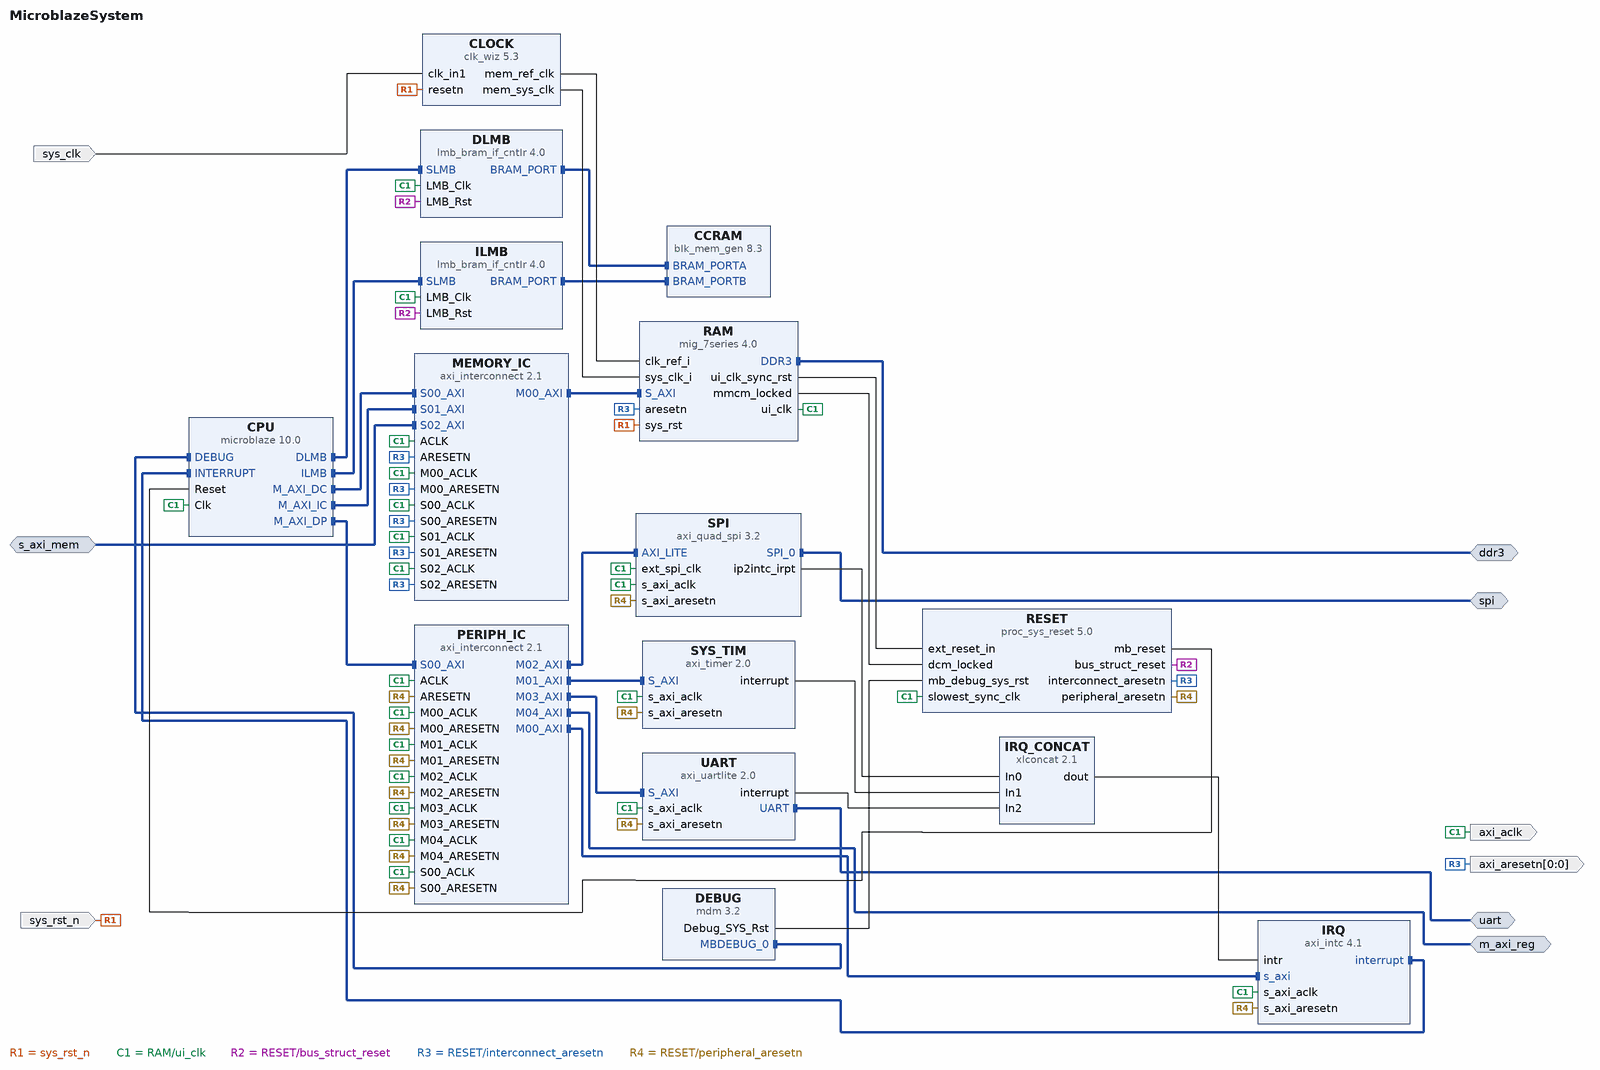
[diagram p0: block diagram of the top level]
# Vivado block design MicroblazeSystem, xc7a35ticsg324-1L, Vivado 2016.4
create_bd_design MicroblazeSystem

create_bd_intf_port -mode Master -vlnv xilinx.com:interface:ddrx_rtl:1.0 ddr3
create_bd_intf_port -mode Slave -vlnv xilinx.com:interface:aximm_rtl:1.0 s_axi_mem
set_property -dict [list \
  CONFIG.DATA_WIDTH 32 \
  CONFIG.PROTOCOL AXI4 \
  CONFIG.ID_WIDTH 2 \
  CONFIG.ADDR_WIDTH 32 \
  CONFIG.AWUSER_WIDTH 0 \
  CONFIG.ARUSER_WIDTH 0 \
  CONFIG.WUSER_WIDTH 0 \
  CONFIG.RUSER_WIDTH 0 \
  CONFIG.BUSER_WIDTH 0 \
  CONFIG.READ_WRITE_MODE READ_WRITE \
  CONFIG.HAS_BURST 1 \
  CONFIG.HAS_LOCK 1 \
  CONFIG.HAS_PROT 1 \
  CONFIG.HAS_CACHE 1 \
  CONFIG.HAS_QOS 1 \
  CONFIG.HAS_REGION 0 \
  CONFIG.HAS_WSTRB 1 \
  CONFIG.HAS_BRESP 1 \
  CONFIG.HAS_RRESP 1 \
  CONFIG.SUPPORTS_NARROW_BURST 1 \
  CONFIG.NUM_READ_OUTSTANDING 2 \
  CONFIG.NUM_WRITE_OUTSTANDING 2 \
  CONFIG.MAX_BURST_LENGTH 256 \
  CONFIG.NUM_READ_THREADS 1 \
  CONFIG.NUM_WRITE_THREADS 1 \
  CONFIG.RUSER_BITS_PER_BYTE 0 \
  CONFIG.WUSER_BITS_PER_BYTE 0 \
] [get_bd_intf_ports s_axi_mem]
create_bd_intf_port -mode Master -vlnv xilinx.com:interface:aximm_rtl:1.0 m_axi_reg
set_property -dict [list \
  CONFIG.DATA_WIDTH 32 \
  CONFIG.PROTOCOL AXI4LITE \
  CONFIG.ADDR_WIDTH 32 \
  CONFIG.NUM_READ_OUTSTANDING 2 \
  CONFIG.NUM_WRITE_OUTSTANDING 2 \
] [get_bd_intf_ports m_axi_reg]
create_bd_intf_port -mode Master -vlnv xilinx.com:interface:uart_rtl:1.0 uart
create_bd_intf_port -mode Master -vlnv xilinx.com:interface:spi_rtl:1.0 spi
create_bd_port -dir I -type rst sys_rst_n
create_bd_port -dir I -type clk sys_clk
set_property -dict {CONFIG.FREQ_HZ 100000000} [get_bd_ports sys_clk]
create_bd_port -dir O -type clk axi_aclk
set_property -dict {CONFIG.ASSOCIATED_BUSIF m_axi_reg:s_axi_mem CONFIG.ASSOCIATED_RESET axi_aresetn} [get_bd_ports axi_aclk]
create_bd_port -dir O -from 0 -to 0 -type rst axi_aresetn

create_bd_cell -type ip -vlnv xilinx.com:ip:mig_7series:4.0 RAM
set_property -dict [list \
  CONFIG.XML_INPUT_FILE mig_a.prj \
  CONFIG.RESET_BOARD_INTERFACE Custom \
  CONFIG.BOARD_MIG_PARAM Custom \
] [get_bd_cells RAM]
create_bd_cell -type ip -vlnv xilinx.com:ip:clk_wiz:5.3 CLOCK
set_property -dict [list \
  CONFIG.CLKOUT2_USED true \
  CONFIG.NUM_OUT_CLKS 2 \
  CONFIG.CLK_OUT1_PORT mem_sys_clk \
  CONFIG.CLK_OUT2_PORT mem_ref_clk \
  CONFIG.CLKOUT1_REQUESTED_OUT_FREQ 333.333 \
  CONFIG.CLKOUT2_REQUESTED_OUT_FREQ 200.000 \
  CONFIG.USE_LOCKED false \
  CONFIG.RESET_PORT resetn \
  CONFIG.MMCM_DIVCLK_DIVIDE 1 \
  CONFIG.MMCM_CLKFBOUT_MULT_F 10.000 \
  CONFIG.MMCM_CLKOUT0_DIVIDE_F 3.000 \
  CONFIG.MMCM_CLKOUT1_DIVIDE 5 \
  CONFIG.RESET_TYPE ACTIVE_LOW \
  CONFIG.CLKOUT1_JITTER 104.542 \
  CONFIG.CLKOUT1_PHASE_ERROR 98.575 \
  CONFIG.CLKOUT2_JITTER 114.829 \
  CONFIG.CLKOUT2_PHASE_ERROR 98.575 \
] [get_bd_cells CLOCK]
create_bd_cell -type ip -vlnv xilinx.com:ip:microblaze:10.0 CPU
set_property -dict [list \
  CONFIG.C_D_AXI 1 \
  CONFIG.C_USE_BARREL 0 \
  CONFIG.C_USE_HW_MUL 1 \
  CONFIG.C_USE_FPU 2 \
  CONFIG.C_NUMBER_OF_PC_BRK 4 \
  CONFIG.C_USE_ICACHE 1 \
  CONFIG.C_CACHE_BYTE_SIZE 8192 \
  CONFIG.C_ICACHE_LINE_LEN 8 \
  CONFIG.C_USE_DCACHE 1 \
  CONFIG.C_DCACHE_BYTE_SIZE 8192 \
  CONFIG.C_DCACHE_LINE_LEN 8 \
] [get_bd_cells CPU]
create_bd_cell -type ip -vlnv xilinx.com:ip:proc_sys_reset:5.0 RESET
create_bd_cell -type ip -vlnv xilinx.com:ip:mdm:3.2 DEBUG
create_bd_cell -type ip -vlnv xilinx.com:ip:lmb_bram_if_cntlr:4.0 DLMB
create_bd_cell -type ip -vlnv xilinx.com:ip:lmb_bram_if_cntlr:4.0 ILMB
create_bd_cell -type ip -vlnv xilinx.com:ip:blk_mem_gen:8.3 CCRAM
set_property -dict [list \
  CONFIG.Memory_Type True_Dual_Port_RAM \
  CONFIG.Enable_B Use_ENB_Pin \
  CONFIG.Use_RSTB_Pin true \
  CONFIG.Port_B_Clock 100 \
  CONFIG.Port_B_Write_Rate 50 \
  CONFIG.Port_B_Enable_Rate 100 \
] [get_bd_cells CCRAM]
create_bd_cell -type ip -vlnv xilinx.com:ip:axi_interconnect:2.1 MEMORY_IC
set_property -dict [list \
  CONFIG.NUM_SI 3 \
  CONFIG.NUM_MI 1 \
  CONFIG.ENABLE_ADVANCED_OPTIONS 1 \
  CONFIG.XBAR_DATA_WIDTH 32 \
] [get_bd_cells MEMORY_IC]
create_bd_cell -type ip -vlnv xilinx.com:ip:axi_uartlite:2.0 UART
set_property -dict {CONFIG.C_BAUDRATE 115200} [get_bd_cells UART]
create_bd_cell -type ip -vlnv xilinx.com:ip:axi_interconnect:2.1 PERIPH_IC
set_property -dict {CONFIG.NUM_MI 5} [get_bd_cells PERIPH_IC]
create_bd_cell -type ip -vlnv xilinx.com:ip:axi_timer:2.0 SYS_TIM
set_property -dict {CONFIG.enable_timer2 1} [get_bd_cells SYS_TIM]
create_bd_cell -type ip -vlnv xilinx.com:ip:axi_quad_spi:3.2 SPI
set_property -dict {CONFIG.C_SPI_MEMORY 2 CONFIG.C_SPI_MODE 2} [get_bd_cells SPI]
create_bd_cell -type ip -vlnv xilinx.com:ip:axi_intc:4.1 IRQ
set_property -dict {CONFIG.C_IRQ_CONNECTION 0} [get_bd_cells IRQ]
create_bd_cell -type ip -vlnv xilinx.com:ip:xlconcat:2.1 IRQ_CONCAT
set_property -dict {CONFIG.NUM_PORTS 3} [get_bd_cells IRQ_CONCAT]

# ---- connections ----

connect_bd_intf_net -intf_net mdm_0_MBDEBUG_0 [get_bd_intf_pins DEBUG/MBDEBUG_0] [get_bd_intf_pins CPU/DEBUG]
connect_bd_intf_net -intf_net lmb_bram_if_cntlr_0_BRAM_PORT [get_bd_intf_pins CCRAM/BRAM_PORTA] [get_bd_intf_pins DLMB/BRAM_PORT]
connect_bd_intf_net -intf_net lmb_bram_if_cntlr_1_BRAM_PORT [get_bd_intf_pins CCRAM/BRAM_PORTB] [get_bd_intf_pins ILMB/BRAM_PORT]
connect_bd_intf_net -intf_net microblaze_0_DLMB [get_bd_intf_pins DLMB/SLMB] [get_bd_intf_pins CPU/DLMB]
connect_bd_intf_net -intf_net microblaze_0_ILMB [get_bd_intf_pins ILMB/SLMB] [get_bd_intf_pins CPU/ILMB]
connect_bd_intf_net [get_bd_intf_pins CPU/M_AXI_DC] [get_bd_intf_pins MEMORY_IC/S00_AXI]
connect_bd_intf_net [get_bd_intf_pins CPU/M_AXI_IC] [get_bd_intf_pins MEMORY_IC/S01_AXI]
connect_bd_intf_net -intf_net axi_interconnect_0_M00_AXI [get_bd_intf_pins MEMORY_IC/M00_AXI] [get_bd_intf_pins RAM/S_AXI]
connect_bd_intf_net [get_bd_intf_pins CPU/M_AXI_DP] [get_bd_intf_pins PERIPH_IC/S00_AXI]
connect_bd_intf_net [get_bd_intf_pins IRQ/s_axi] [get_bd_intf_pins PERIPH_IC/M00_AXI]
connect_bd_intf_net [get_bd_intf_pins PERIPH_IC/M01_AXI] [get_bd_intf_pins SYS_TIM/S_AXI]
connect_bd_intf_net [get_bd_intf_pins PERIPH_IC/M02_AXI] [get_bd_intf_pins SPI/AXI_LITE]
connect_bd_intf_net [get_bd_intf_pins PERIPH_IC/M03_AXI] [get_bd_intf_pins UART/S_AXI]
connect_bd_intf_net [get_bd_intf_pins CPU/INTERRUPT] [get_bd_intf_pins IRQ/interrupt]
connect_bd_intf_net [get_bd_intf_ports ddr3] [get_bd_intf_pins RAM/DDR3]
connect_bd_intf_net [get_bd_intf_ports s_axi_mem] [get_bd_intf_pins MEMORY_IC/S02_AXI]
connect_bd_intf_net [get_bd_intf_ports m_axi_reg] [get_bd_intf_pins PERIPH_IC/M04_AXI]
connect_bd_intf_net [get_bd_intf_ports uart] [get_bd_intf_pins UART/UART]
connect_bd_intf_net [get_bd_intf_ports spi] [get_bd_intf_pins SPI/SPI_0]
connect_bd_net -net sys_rst_1 [get_bd_ports sys_rst_n] [get_bd_pins RAM/sys_rst] [get_bd_pins CLOCK/resetn]
connect_bd_net [get_bd_ports sys_clk] [get_bd_pins CLOCK/clk_in1]
connect_bd_net -net clk_wiz_0_mem_ref_clk [get_bd_pins CLOCK/mem_ref_clk] [get_bd_pins RAM/clk_ref_i]
connect_bd_net -net clk_wiz_0_mem_sys_clk [get_bd_pins CLOCK/mem_sys_clk] [get_bd_pins RAM/sys_clk_i]
connect_bd_net [get_bd_pins RAM/ui_clk] \
  [get_bd_ports axi_aclk] [get_bd_pins CPU/Clk] [get_bd_pins RESET/slowest_sync_clk] [get_bd_pins ILMB/LMB_Clk] \
  [get_bd_pins DLMB/LMB_Clk] [get_bd_pins UART/s_axi_aclk] [get_bd_pins SYS_TIM/s_axi_aclk] [get_bd_pins IRQ/s_axi_aclk] \
  [get_bd_pins SPI/s_axi_aclk] [get_bd_pins SPI/ext_spi_clk] [get_bd_pins MEMORY_IC/ACLK] [get_bd_pins MEMORY_IC/S00_ACLK] \
  [get_bd_pins MEMORY_IC/M00_ACLK] [get_bd_pins MEMORY_IC/S01_ACLK] [get_bd_pins MEMORY_IC/S02_ACLK] \
  [get_bd_pins PERIPH_IC/ACLK] [get_bd_pins PERIPH_IC/S00_ACLK] [get_bd_pins PERIPH_IC/M00_ACLK] \
  [get_bd_pins PERIPH_IC/M01_ACLK] [get_bd_pins PERIPH_IC/M02_ACLK] [get_bd_pins PERIPH_IC/M03_ACLK] \
  [get_bd_pins PERIPH_IC/M04_ACLK]
connect_bd_net [get_bd_pins RAM/ui_clk_sync_rst] [get_bd_pins RESET/ext_reset_in]
connect_bd_net [get_bd_pins RAM/mmcm_locked] [get_bd_pins RESET/dcm_locked]
connect_bd_net -net proc_sys_reset_0_mb_reset [get_bd_pins RESET/mb_reset] [get_bd_pins CPU/Reset]
connect_bd_net -net mdm_0_Debug_SYS_Rst [get_bd_pins DEBUG/Debug_SYS_Rst] [get_bd_pins RESET/mb_debug_sys_rst]
connect_bd_net -net proc_sys_reset_0_bus_struct_reset [get_bd_pins RESET/bus_struct_reset] [get_bd_pins DLMB/LMB_Rst] [get_bd_pins ILMB/LMB_Rst]
connect_bd_net [get_bd_pins RESET/interconnect_aresetn] \
  [get_bd_ports axi_aresetn] [get_bd_pins RAM/aresetn] [get_bd_pins MEMORY_IC/S02_ARESETN] \
  [get_bd_pins MEMORY_IC/S01_ARESETN] [get_bd_pins MEMORY_IC/M00_ARESETN] [get_bd_pins MEMORY_IC/S00_ARESETN] \
  [get_bd_pins MEMORY_IC/ARESETN]
connect_bd_net [get_bd_pins RESET/peripheral_aresetn] \
  [get_bd_pins UART/s_axi_aresetn] [get_bd_pins SYS_TIM/s_axi_aresetn] [get_bd_pins SPI/s_axi_aresetn] \
  [get_bd_pins IRQ/s_axi_aresetn] [get_bd_pins PERIPH_IC/M02_ARESETN] [get_bd_pins PERIPH_IC/M01_ARESETN] \
  [get_bd_pins PERIPH_IC/M00_ARESETN] [get_bd_pins PERIPH_IC/S00_ARESETN] [get_bd_pins PERIPH_IC/ARESETN] \
  [get_bd_pins PERIPH_IC/M03_ARESETN] [get_bd_pins PERIPH_IC/M04_ARESETN]
connect_bd_net [get_bd_pins IRQ_CONCAT/dout] [get_bd_pins IRQ/intr]
connect_bd_net [get_bd_pins SPI/ip2intc_irpt] [get_bd_pins IRQ_CONCAT/In0]
connect_bd_net [get_bd_pins SYS_TIM/interrupt] [get_bd_pins IRQ_CONCAT/In1]
connect_bd_net [get_bd_pins UART/interrupt] [get_bd_pins IRQ_CONCAT/In2]

# ---- address map ----
assign_bd_address -offset 0x00000000 -range 32K -target_address_space [get_bd_addr_spaces CPU/Data] [get_bd_addr_segs DLMB/SLMB/Mem]
assign_bd_address -offset 0x40000000 -range 4K -target_address_space [get_bd_addr_spaces CPU/Data] [get_bd_addr_segs IRQ/S_AXI/Reg]
assign_bd_address -offset 0x40001000 -range 4K -target_address_space [get_bd_addr_spaces CPU/Data] [get_bd_addr_segs SYS_TIM/S_AXI/Reg]
assign_bd_address -offset 0x40002000 -range 4K -target_address_space [get_bd_addr_spaces CPU/Data] [get_bd_addr_segs SPI/AXI_LITE/Reg]
assign_bd_address -offset 0x40003000 -range 4K -target_address_space [get_bd_addr_spaces CPU/Data] [get_bd_addr_segs UART/S_AXI/Reg]
assign_bd_address -offset 0x40004000 -range 4K -target_address_space [get_bd_addr_spaces CPU/Data] [get_bd_addr_segs m_axi_reg/Reg]
assign_bd_address -offset 0x80000000 -range 256M -target_address_space [get_bd_addr_spaces CPU/Data] [get_bd_addr_segs RAM/memmap/memaddr]
assign_bd_address -offset 0x00000000 -range 64K -target_address_space [get_bd_addr_spaces CPU/Instruction] [get_bd_addr_segs ILMB/SLMB/Mem]
assign_bd_address -offset 0x80000000 -range 256M -target_address_space [get_bd_addr_spaces CPU/Instruction] [get_bd_addr_segs RAM/memmap/memaddr]
assign_bd_address -offset 0x80000000 -range 256M -target_address_space [get_bd_addr_spaces s_axi_mem] [get_bd_addr_segs RAM/memmap/memaddr]

validate_bd_design
save_bd_design
